# EAGLE design ultra-low-noise-psu-NEG-v0001 (EAGLE 6.4)
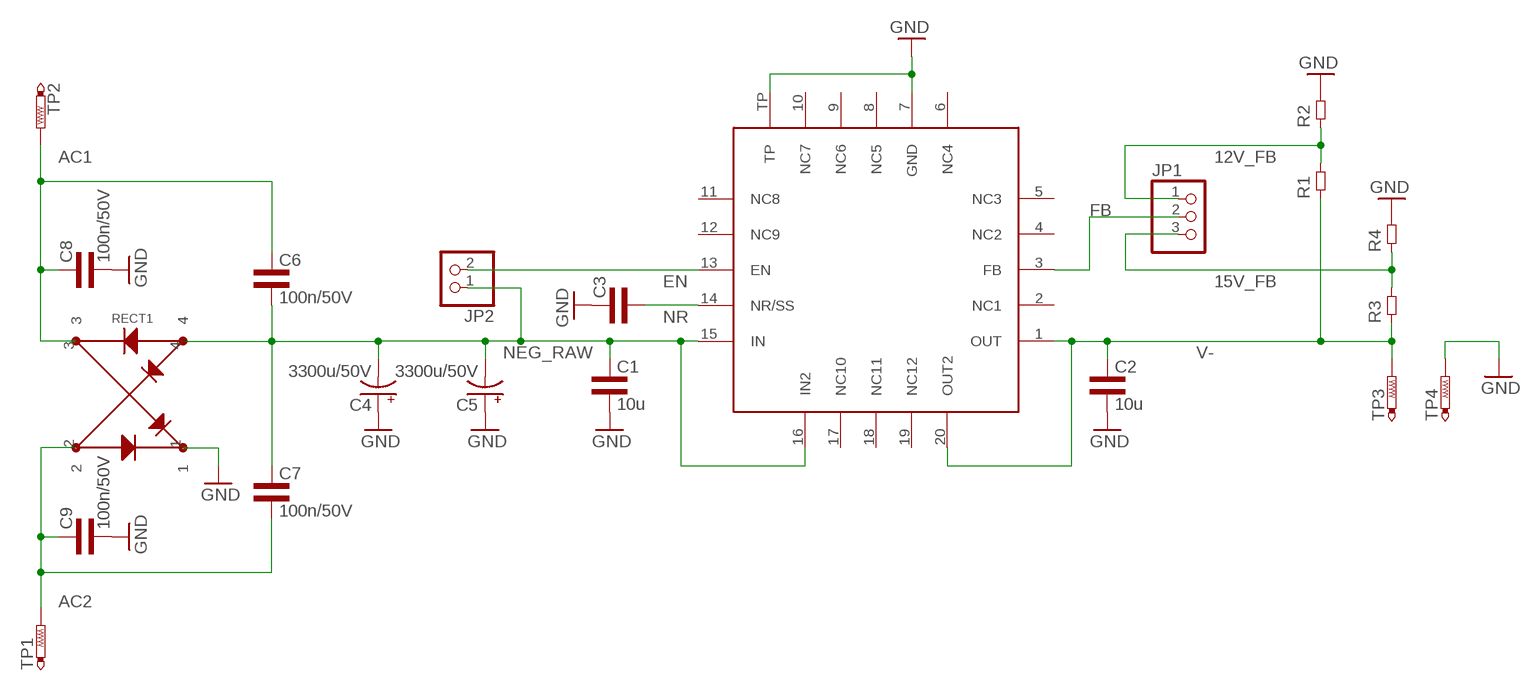
[diagram p0: schematic, sheet 1]

## Parts
C1  10u  CAP0805L3  [0805L3]
C2  10u  CAP0805L3  [0805L3]
C3  CAP0603L3  [0603L3]
C4  3300u/50V  CPOL-USE7.5-18  [E7,5-18]
C5  3300u/50V  CPOL-USE7.5-18  [E7,5-18]
C6  100n/50V  CAP0805L3  [0805L3]
C7  100n/50V  CAP0805L3  [0805L3]
C8  100n/50V  CAP0805L3  [0805L3]
C9  100n/50V  CAP0805L3  [0805L3]
JP1  PINHD-1X3  [1X03]
JP2  PINHD-1X2  [1X02]
R1  RES0603L3  [0603L3]
R2  RES0603L3  [0603L3]
R3  RES0603L3  [0603L3]
R4  RES0603L3  [0603L3]
RECT1  RECTIFIER_Z4GP206  [RECTIFIER_ABS-4]
TP1  PTR1PAD1-20  [P1-20]
TP2  PTR1PAD1-20  [P1-20]
TP3  PTR1PAD1-20  [P1-20]
TP4  PTR1PAD1-20  [P1-20]
U$1  POWER-SUPPLY_POS_V1_TI_LDO_TPS7A3301RGWT  [POWER-SUPPLY_POS_V1_TI_LDO_VQFN-20]

## Nets
12V_FB: JP1.1 R1.P$2 R2.P$1
15V_FB: JP1.3 R3.P$2 R4.P$1
AC1: C6.1 C8.1 RECT1.3 TP2.TP
AC2: C7.2 C9.1 RECT1.2 TP1.TP
EN: JP2.2 U$1.13(EN)
FB: JP1.2 U$1.3(FB)
GND: C1.2 C2.2 C3.P$1 C4.+ C5.+ C8.2 C9.2 R2.P$2 R4.P$2 RECT1.1 TP4.TP U$1.7(GND) U$1.TP
NEG_RAW: C1.1 C4.- C5.- C6.2 C7.1 JP2.1 RECT1.4 U$1.15(IN) U$1.16(IN2)
NR: C3.P$2 U$1.14(NR/SS)
V-: C2.1 R1.P$1 R3.P$1 TP3.TP U$1.1(OUT) U$1.20(OUT2)
Unconnected: U$1.2(NC1) U$1.4(NC2) U$1.5(NC3) U$1.6(NC4) U$1.8(NC5) U$1.9(NC6) U$1.10(NC7) U$1.11(NC8) U$1.12(NC9) U$1.17(NC10) U$1.18(NC11) U$1.19(NC12)

## Library data of the parts
C1-C3 C6-C9 = common:CAP
C4 C5 = rcl:CPOL-US: POLARIZED CAPACITOR, American symbol
JP1 = adafruit:PINHD-1X3: PIN HEADER
JP2 = pinhead:PINHD-1X2: PIN HEADER
R1-R4 = common:RES
RECT1 = my_dac_amp:RECTIFIER_Z4GP206
TP1-TP4 = testpad:PTR1: TEST PIN
U$1 = my_dac_amp:POWER-SUPPLY_POS_V1_TI_LDO_TPS7A3301RGWT: Ultra-Low Noise NEGATIVE Voltage Reglator

## Board
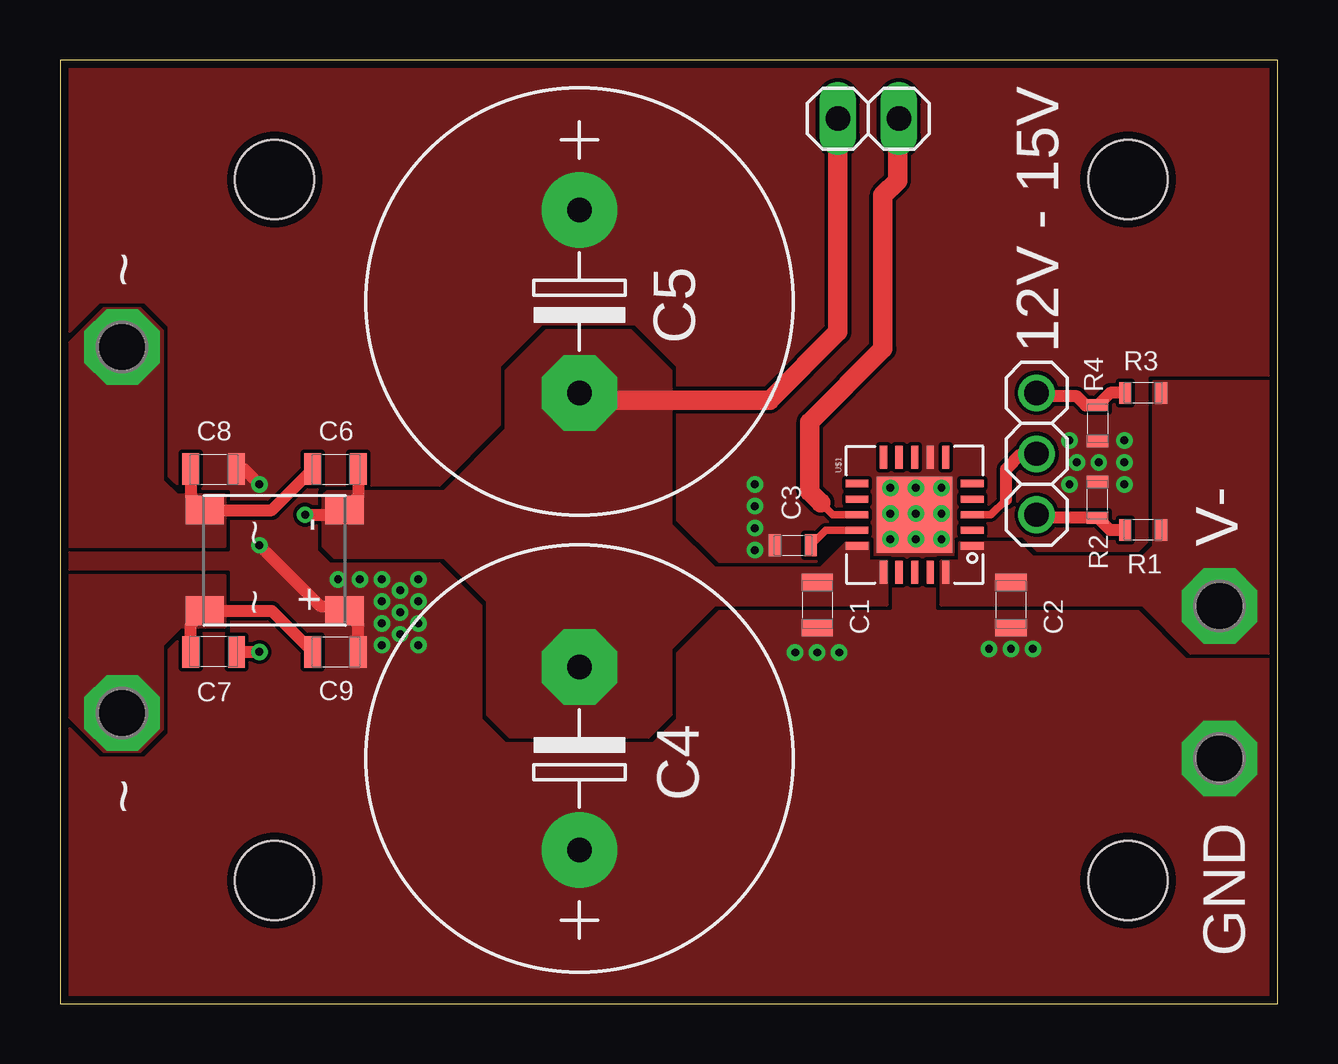
[diagram p1: board, top side]
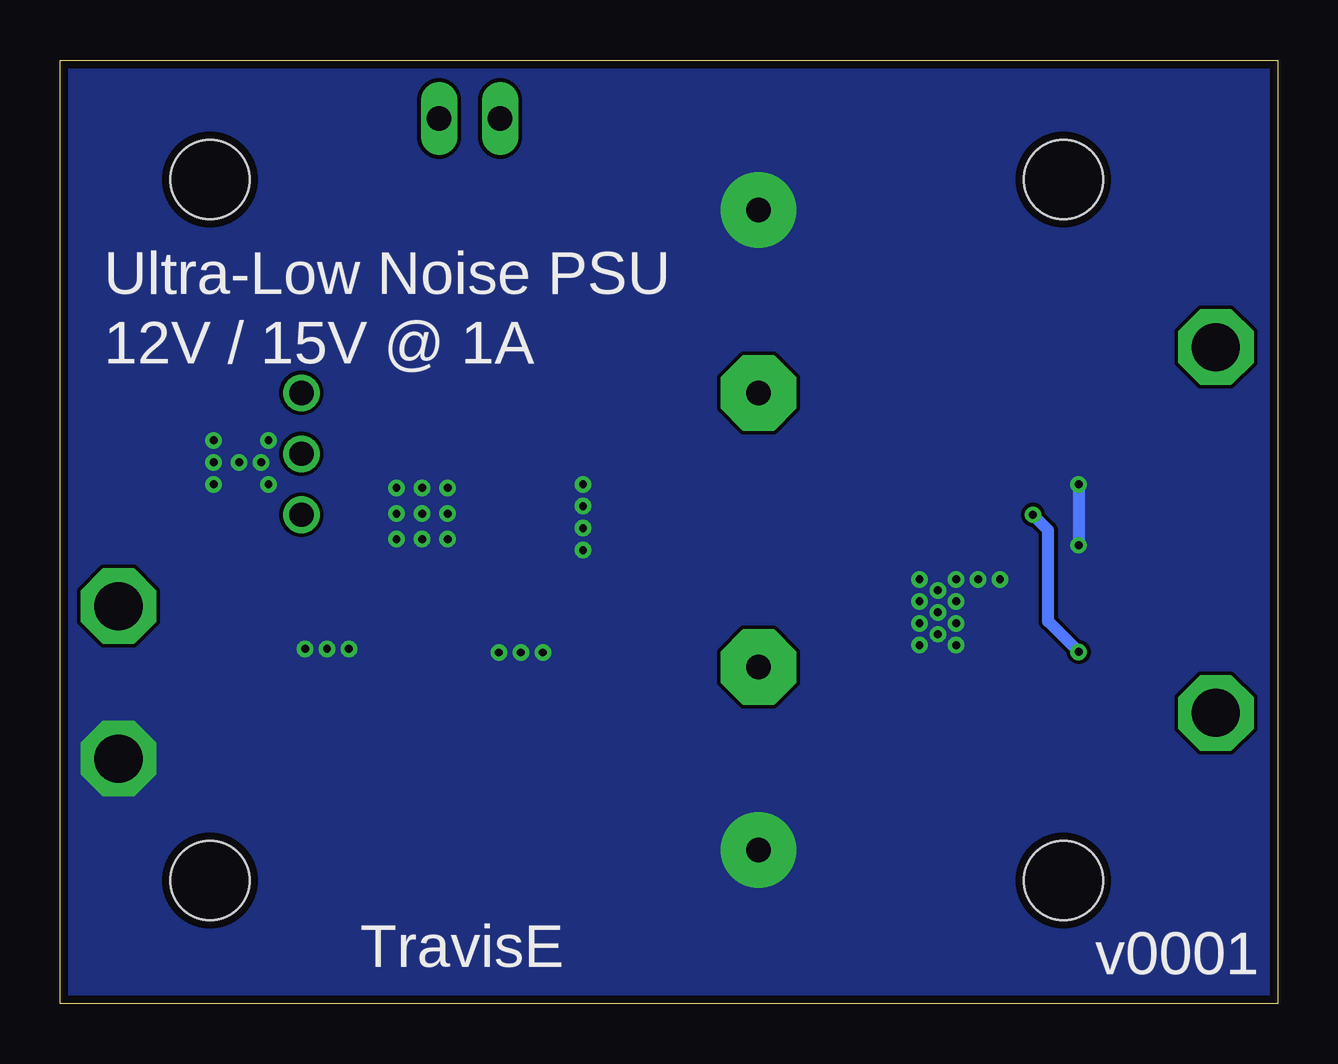
[diagram p2: board, bottom side, seen from below]

Size 50.75 x 39.32 mm. Coordinates in mm from the lower left corner, seen from the top.
Outline: 0,0 50.75,0 50.75,39.32 0,39.32 0,0
Copper layers (1*16): Top 0.035mm / dielectric 1.5mm / Bottom 0.035mm
Design rules "default *": minimum track width 6mil, minimum drill 13mil, track to track 6mil, track to pad 6mil, pad to pad 6mil, via to via 6mil, smd to smd 6mil, copper to edge 13mil, drill to drill 6mil, minimum pad ring 7mil, minimum via ring 7mil, stop-mask expansion 4mil, vias tented up to drill 16mil, thermal gap 10mil
Holes 3.3 mm at 8.94,5.13 8.94,34.34 44.5,34.34 44.5,5.13

### Footprints (pad centres in the part's own frame; a part is rotated, then mirrored left to right if it is on the bottom)
0805L3 = smd 0.7 x 1.3: 1 -0.95,0; 2 0.95,0
0603L3 = smd 0.5 x 0.9: P$1 -0.75,0; P$2 0.75,0
E7,5-18 = drill 1.016 pad 3.15: + -3.81,0 | drill 1.016 pad 3.15 octagon: - 3.81,0
1X03 = drill 1.016: 1 -2.54,0; 2 0,0; 3 2.54,0
1X02 = drill 1.016 long: 1 -1.27,0; 2 1.27,0
RECTIFIER_ABS-4 = smd 1.2 x 1.6: 1 2.1,2.91; 2 2.1,-2.91; 3 -2.1,-2.91; 4 -2.1,2.91
P1-20 = drill 2.007 pad 3.15 octagon: TP 0,0
POWER-SUPPLY_POS_V1_TI_LDO_VQFN-20 = smd 0.3 x 0.95: 1 -1.3,-2.4; 2 -0.65,-2.4; 3 0,-2.4; 4 0.65,-2.4; 5 1.3,-2.4; 11 1.3,2.4; 12 0.65,2.4; 13 0,2.4; 14 -0.65,2.4; 15 -1.3,2.4 | smd 0.95 x 0.3: 6 2.4,-1.3; 7 2.4,-0.65; 8 2.4,0; 9 2.4,0.65; 10 2.4,1.3; 16 -2.4,1.3; 17 -2.4,0.65; 18 -2.4,0; 19 -2.4,-0.65; 20 -2.4,-1.3 | smd 3.15 x 3.15: TP 0,0

### Placement (x,y rotation side)
C1  31.55,16.61 270 top
C2  39.62,16.61 270 top
C3  30.53,19.1 0 top
C4  21.64,10.21 90 top
C5  21.64,29.26 270 top
C6  11.48,22.28 0 top
C7  6.4,14.66 180 top
C8  6.4,22.28 0 top
C9  11.48,14.66 0 top
JP1  40.69,22.91 90 top
JP2  33.68,36.88 0 top
R1  45.14,19.74 180 top
R2  43.23,21.01 90 top
R3  45.14,25.45 180 top
R4  43.23,24.18 270 top
RECT1  8.94,18.47 270 top
TP1  2.59,12.12 0 top
TP2  2.59,27.36 0 top
TP3  48.31,16.56 0 top
TP4  48.31,10.21 0 top
U$1  35.61,20.37 90 top

### Tracks (layer width: path | path; a pad name or v marks a point on that pad's centre or on a via)
12V_FB
  Top 0.508: JP1.1 40.81,20.26 R2.P$1 43.75,19.74 R1.P$2
15V_FB
  Top 0.508: R3.P$2 43.75,25.45 R4.P$1 42.73,24.93 42.37,25.3 40.84,25.3 JP1.3
AC1
  Top 0.508: C6.1 8.82,20.57 RECT1.3 5.45,21.15 C8.1
  pour Top (no thermals): 6.86,21.18 4.88,21.18 4.27,21.79 4.27,28.04 3.35,28.96 1.83,28.96 0.3,27.43 0.3,19.05 6.86,19.05
AC2
  Top 0.508: C9.1 8.82,16.37 RECT1.2 5.45,15.79 C7.2
  pour Top (no thermals): 6.86,15.7 5.03,15.7 4.27,14.94 4.27,11.43 3.35,10.52 1.83,10.52 0.3,12.04 0.3,17.83 6.86,17.83
EN
  Top 0.305: U$1.13 32.21,20.37 31.7,20.88
  Top 0.813: 31.7,20.88 31.24,21.34 31.24,24.23 34.29,27.28 34.29,33.68 34.9,34.29 34.9,36.83 JP2.2
FB
  Top 0.305: U$1.3 38.79,20.37 39.42,21.01
  Top 0.508: 39.42,21.01 39.42,22.28 40.06,22.91 JP1.2
GND  (via drill 0.33)
  Top 0.508: C8.2 7.67,22.28 v8.31,21.64 | v8.31,19.1 10.85,16.56 11.66,16.56 RECT1.1 12.43,15.79 C9.2
  Bottom 0.508: v8.31,21.64 v8.31,19.1
  other vias: 42.06,23.47 42.37,22.56 42.06,21.64 43.28,22.56 44.35,23.47 44.35,22.56 44.35,21.64 11.58,17.68 12.5,17.68 13.41,17.68 13.41,16.76 13.41,15.85 13.41,14.94 14.17,16.31 14.17,15.39 14.17,17.22 14.94,17.68 14.94,16.76 14.94,15.85 14.94,14.94 28.96,19.81 28.96,18.9 30.63,14.63 31.55,14.63 32.46,14.63 38.71,14.78 39.62,14.78 40.54,14.78 28.96,20.73 28.96,21.64 35.66,20.42 35.66,21.49 35.66,19.35 34.59,19.35 36.73,19.35 36.73,20.42 36.73,21.49 34.59,21.49 34.59,20.42
  pour Bottom (rank 6, no thermals): 0.3,39.01 50.44,39.01 50.44,0.3 0.3,0.3
  pour Top (rank 6, no thermals): 0.3,39.01 50.44,39.01 50.44,0.3 0.3,0.3
NEG_RAW  (via drill 0.33)
  Top 0.508: C6.2 12.43,21.15 RECT1.4 11.66,20.37 v10.21,20.37 | C7.1 v8.31,14.66
  Top 0.813: JP2.1 32.41,27.99 29.57,25.15 21.95,25.15 C5.-
  Bottom 0.508: v8.31,14.66 9.58,15.93 9.58,19.74 v10.21,20.37
  pour Top (no thermals): 10.97,21.18 10.97,19.05 11.43,18.59 16,18.59 17.83,16.76 17.83,12.04 18.75,11.13 24.54,11.13 25.45,12.04 25.45,26.37 23.77,28.04 20.27,28.04 18.59,26.37 18.59,23.93 16,21.34 11.13,21.34
  pour Top (no thermals): 33.68,19.2 32.77,19.2 32.31,18.75 31.7,18.14 30.48,18.14 27.28,18.14 25.45,19.96 25.45,26.37 23.77,28.04 20.27,28.04 18.59,26.37 18.59,11.43 18.9,11.13 24.54,11.13 25.45,12.04 25.45,14.78 27.28,16.61 34.44,16.61 34.44,18.44 33.68,18.44
NR
  Top 0.305: U$1.14 31.9,19.72 C3.P$2
V-
  pour Top (no thermals): 36.73,18.44 36.73,16.61 45.11,16.61 47.09,14.63 50.44,14.63 50.44,25.91 45.57,25.91 45.57,19.05 45.11,18.59 40.54,18.59 39.93,19.2 37.49,19.2 37.49,18.44

### Text on the board
tPlace: ~ | 12V - 15V | V- | ~ | GND
bPlace: Ultra-Low Noise PSU | 12V / 15V @ 1A | TravisE | v0001